# Altium project 65wLEDPowerSupply.PrjPcb (part 2 of 2)

## Sheet LED Driver.SchDoc
size 420 x 297 mm; Organization: Altium Limited; Address1: L3, 12a Rodborough Rd; Address2: Frenchs Forest; Address3: NSW; Address4: Australia 2086
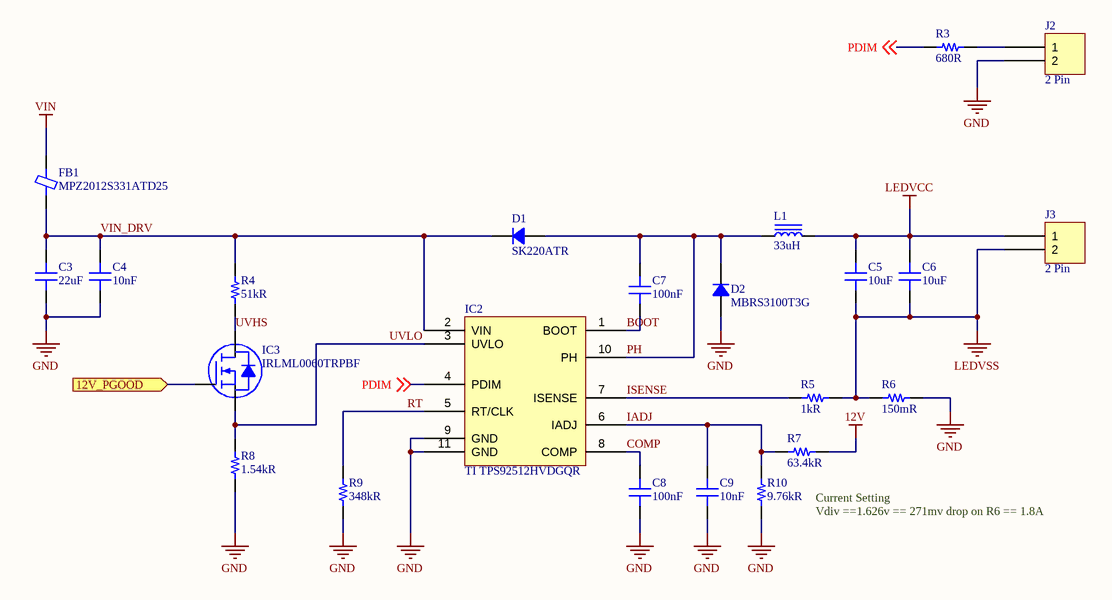
[diagram p2: LED Driver.SchDoc]

### Parts
C3  22uF  [TDK CKG57N]
C4  10nF  [CAP 0603/1608]
C5  10uF  [CAP 1210/3225 - 2.8MM]
C6  10uF  [CAP 1210/3225 - 2.8MM]
C7  100nF  [CAP 0805/2012]
C8  100nF  [CAP 0402/1005]
C9  10nF  [CAP 0402/1005]
D1  SK220ATR  [ST DO214AC SMA]
D2  MBRS3100T3G  [ST DO214AB SMC]
FB1  MPZ2012S331ATD25  [FER 0805/2012]
IC2  TI TPS92512HVDGQR  [TI MSOP-10 DGQ]
IC3  IRLML0060TRPBF  [INFINEON SOT-23-3]
J2  2 Pin  [TE 282834-2]
J3  2 Pin  [FCI 06-381-2PIN]
L1  33uH  [TDK SLF12575]
R3  680R  [RES 0402/1005]
R4  51kR  [RES 0402/1005]
R5  1kR  [RES 0402/1005]
R6  150mR  [STACKPOLE CSRN2512]
R7  63.4kR  [RES 0402/1005]
R8  1.54kR  [RES 0402/1005]
R9  348kR  [RES 0402/1005]
R10  9.76kR  [RES 0402/1005]

### Ports
12V_PGOOD (in)

### Nets
12V: R7.1
GND: C3.1 C4.1 C8.2 C9.1 D2.1 IC2.9(GND) IC2.11(GND) J2.2 R6.1 R8.1 R9.1 R10.1
LEDVCC: C5.2 C6.2 J3.1 L1.2
LEDVSS: C5.1 C6.1 J3.2 R5.2 R6.2
VIN: FB1.2
12V_PGOOD: IC3.1(G) ; port 12V_PGOOD
BOOT: C7.2 IC2.1(BOOT)
COMP: C8.1 IC2.8(COMP)
IADJ: C9.2 IC2.6(IADJ) R7.2 R10.2
ISENSE: IC2.7(ISENSE) R5.1
PDIM: IC2.4(PDIM) R3.1 ; off-sheet PDIM
PH: C7.1 D1.1 D2.2 IC2.10(PH) L1.1
RT: IC2.5(RT/CLK) R9.2
UVHS: IC3.3(D) R4.1
UVLO: IC2.3(UVLO) IC3.2(S) R8.2
VIN_DRV: C3.2 C4.2 D1.2 FB1.1 IC2.2(VIN) R4.2
NetJ2_1: J2.1 R3.2

### Notes on the sheet
- Current Setting
- Vdiv ==1.626v == 271mv drop on R6 == 1.8A
- 8
- 7
- 6
- 5
- 4
- 3
- DWG. NO.
- REV.
- SHT.
- REVISION
- 2
- DESCRIPTION
- DATE
- 1
- APPROVED
- THIS DOCUMENT AND THE DATA DISCLOSED HEREIN OR HEREWITH IS THE PROPERTY OF ALTIUM LIMITED AND MAY BE FREELY DISTRIBUTED IN WHOLE. NO RIGHTS ARE RESERVED OR EXPRESS OR IMPLIED WARANTEE GIVEN.
- F
- E
- D
- C
- B
- A
- SCALE:
- A3
- SIZE
- CAGE CODE
- FILE NAME
- DWG NO.
- SHEET
- OF
- REV

### Library data of the parts
C3 = Capacitor: TDK - CKG57NX7S2A226M500JH - CAP, 22µF, 100V, 20%, X7S, 2220; Lead/Base Style: L-Lead; Supplier 1: Digi-Key; Supplier Part Number 1: 445-5217-1-ND; Manufacturer 1: TDK; Manufacturer Part Number 1: CKG57NX7S2A226M500JH; RoHS: Yes; Category: Ceramic Capacitors; Stock 1: 59963; Pricing 1: 1=5.22000, 10=4.69600, 100=3.54830, 500=2.92216 (USD); Mount: Surface Mount; Case/Package: 2220; Number of Pins: 2; Case Code (Metric): 5750; Case Code (Imperial): 2220; Min Operating Temperature: -55°C; Max Operating Temperature: 125°C; Capacitance: 22uF; Tolerance: 20%; Voltage Rating: 100V; Packaging: Tape and Reel; Voltage Rating (DC): 100V; Dielectric: X7S; Termination: Metal; Package Quantity: 1; Composition: Ceramic; Voltage: 100V; Length: 6mm; Height: 5mm; Depth: 5mm; Width: 0.197inch; Thickness: 0.217inch; Lead Free: Lead Free; REACH SVHC: No SVHC; ComponentLink1URL: https://datasheet.ciiva.com/30054/506print-detail-pdf-phplangenpart-nockg57nx7s2a226m500jhimp-unit-xmh-30054990.pdf?src-supplier=Onlinecomponents.com; ComponentLink1Description: https://datasheet.ciiva.com/30054/506print-detail-pdf-phplangenpart-nockg57nx7s2a226m500jhimp-unit-xmh-30054990.pdf?src-supplier=Onlinecomponents.com; ComponentLink2URL: https://datasheet.ciiva.com/24216/ckg57nx7s2a226m500jh-266237-24216591.pdf?src-supplier=Mouser; ComponentLink2Description: https://datasheet.ciiva.com/24216/ckg57nx7s2a226m500jh-266237-24216591.pdf?src-supplier=Mouser; ComponentLink3URL: https://datasheet.ciiva.com/8079/1796627-8079399.pdf?src-supplier=Element14; ComponentLink3Description: https://datasheet.ciiva.com/8079/1796627-8079399.pdf?src-supplier=Element14; ComponentLink4URL: https://datasheet.ciiva.com/6283/mlcc-commercial-megacap-en-6283517.pdf?src-supplier=Digi-Key; ComponentLink4Description: https://datasheet.ciiva.com/6283/mlcc-commercial-megacap-en-6283517.pdf?src-supplier=Digi-Key; ComponentLink5URL: https://datasheet.ciiva.com/6283/mlcc-commercial-megacap-en-6283519.pdf?src-supplier=Digi-Key; ComponentLink5Description: https://datasheet.ciiva.com/6283/mlcc-commercial-megacap-en-6283519.pdf?src-supplier=Digi-Key
C4 = Capacitor: Multilayer Ceramic Capacitors MLCC - SMD/SMT .01uF 100Volts 10%; Manufacturer 1: Murata; Manufacturer Part Number 1: GRM188R72A103KA01D; Dielectric: X7R; Voltage Rating: 100V; Supplier 1: Farnell; Supplier Part Number 1: 2666521; RoHS: Yes; Category: Ceramic Capacitors; Stock 1: 4000; Pricing 1: 4000=0.01000, 20000=0.00740, 40000=0.00630 (GBP); Mount: Surface Mount; Case/Package: 0603; Case Code (Metric): 1608; Case Code (Imperial): 0603; Material: Ceramic; Min Operating Temperature: -55°C; Max Operating Temperature: 125°C; Capacitance: 10nF; Tolerance: 10%; Package Quantity: 4000; Packaging: Tape and Reel; Voltage Rating (DC): 100V; Termination: SMD/SMT; Voltage: 100V; Length: 1.6mm; Height: 0.8mm; Width: 0.031inch; Thickness: 0.035inch; Depth: 0.8mm; Radiation Hardening: No; REACH SVHC: No SVHC; Lead Free: Lead Free; ComponentLink1URL: https://datasheet.ciiva.com/6270/product-6270672.pdf?src-supplier=Digi-Key; ComponentLink1Description: https://datasheet.ciiva.com/6270/product-6270672.pdf?src-supplier=Digi-Key; ComponentLink2URL: https://datasheet.ciiva.com/18100/getdatasheetpartid-27582-18100672.pdf?src-supplier=Verical; ComponentLink2Description: https://datasheet.ciiva.com/18100/getdatasheetpartid-27582-18100672.pdf?src-supplier=Verical; ComponentLink3URL: https://datasheet.ciiva.com/11789/0900766b80ef921d-11789050.pdf?src-supplier=RSComponents; ComponentLink3Description: https://datasheet.ciiva.com/11789/0900766b80ef921d-11789050.pdf?src-supplier=RSComponents; ComponentLink4URL: https://datasheet.ciiva.com/29201/451970-da-01-en-vs-kondensator-0603-29201715.pdf?src-supplier=Conrad; ComponentLink4Description: https://datasheet.ciiva.com/29201/451970-da-01-en-vs-kondensator-0603-29201715.pdf?src-supplier=Conrad; ComponentLink5URL: https://datasheet.ciiva.com/6270/partnumbering-e-01-6270678.pdf?src-supplier=Digi-Key; ComponentLink5Description: https://datasheet.ciiva.com/6270/partnumbering-e-01-6270678.pdf?src-supplier=Digi-Key
C5 C6 = Capacitor: CAP CER 10UF 50V X7R 1210; Manufacturer 1: Samsung; Manufacturer Part Number 1: CL32B106KBJNNWE; Tolerance: 10%; Supplier 1: Digi-Key; Supplier Part Number 1: 1276-3388-1-ND; RoHS: Yes; Category: Ceramic Capacitors; Stock 1: 561396; Pricing 1: 1=0.66000, 10=0.46700, 100=0.30740, 500=0.22770 (USD); Mount: Surface Mount; Case/Package: 1210; Case Code (Metric): 3225; Case Code (Imperial): 1210; Min Operating Temperature: -55°C; Max Operating Temperature: 125°C; Capacitance: 10uF; Voltage Rating: 50V; Package Quantity: 1; Packaging: Tape and Reel; Dielectric: X7R; Length: 0.126inch; Width: 0.098inch; Thickness: 0.106inch; Lead Free: Lead Free; ComponentLink1URL: https://datasheet.ciiva.com/25721/cl32b106kbjnnwe-25721651.pdf?src-supplier=Digi-Key; ComponentLink1Description: https://datasheet.ciiva.com/25721/cl32b106kbjnnwe-25721651.pdf?src-supplier=Digi-Key
C7 = Capacitor: Multilayer Ceramic Capacitors MLCC - SMD/SMT 50volts 0.1uF X7R 20%; Manufacturer 1: KEMET; Manufacturer Part Number 1: C0805C104M5RACTU; Voltage Rating (DC): 50V; Supplier 1: Digi-Key; Supplier Part Number 1: 399-1169-1-ND; RoHS: Yes; Category: Ceramic Capacitors; Stock 1: 1391611; Pricing 1: 1=0.10000, 10=0.07400, 100=0.03290, 500=0.02348, 1000=0.01845 (USD); Mount: Surface Mount; Case/Package: 0805; Dielectric Material: Ceramic; Min Operating Temperature: -55°C; Max Operating Temperature: 125°C; Capacitance: 100nF; Tolerance: 20%; Packaging: Tape and Reel; Dielectric: X7R; Length: 2mm; Height: 0.9mm; Depth: 1.25mm; Radiation Hardening: No; ComponentLink1URL: http://uk.rs-online.com/webdocs/13da/0900766b813daa06.pdf?src-supplier=RSComponents; ComponentLink1Description: http://uk.rs-online.com/webdocs/13da/0900766b813daa06.pdf?src-supplier=RSComponents; ComponentLink2URL: http://www.farnell.com/datasheets/2315435.pdf?src-supplier=Farnell; ComponentLink2Description: http://www.farnell.com/datasheets/2315435.pdf?src-supplier=Farnell; ComponentLink3URL: http://uk.rs-online.com/webdocs/1515/0900766b81515223.pdf?src-supplier=RSComponents; ComponentLink3Description: http://uk.rs-online.com/webdocs/1515/0900766b81515223.pdf?src-supplier=RSComponents; ComponentLink4URL: http://www.farnell.com/datasheets/2739857.pdf?src-supplier=Farnell; ComponentLink4Description: http://www.farnell.com/datasheets/2739857.pdf?src-supplier=Farnell; ComponentLink5URL: https://www.verical.com/server-webapp/html/getDatasheet?partID=774625&src-supplier=Verical; ComponentLink5Description: https://www.verical.com/server-webapp/html/getDatasheet?partID=774625&src-supplier=Verical; ComponentLink6URL: http://www.farnell.com/datasheets/2120141.pdf?src-supplier=Farnell; ComponentLink6Description: http://www.farnell.com/datasheets/2120141.pdf?src-supplier=Farnell; ComponentLink7URL: http://components.arrow.com/part/dataview/0323_00324812?src-supplier=Arrow+Europe; ComponentLink7Description: http://components.arrow.com/part/dataview/0323_00324812?src-supplier=Arrow+Europe; ComponentLink8URL: http://uk.rs-online.com/webdocs/1528/0900766b81528e2f.pdf?src-supplier=RSComponents; ComponentLink8Description: http://uk.rs-online.com/webdocs/1528/0900766b81528e2f.pdf?src-supplier=RSComponents; ComponentLink9URL: http://www.farnell.com/datasheets/2739857.pdf?src-supplier=Newark; ComponentLink9Description: http://www.farnell.com/datasheets/2739857.pdf?src-supplier=Newark; ComponentLink10URL: http://www.alliedelec.com/m/d/9bfe7773041ffe9d406e68bc7b377fdd.pdf?src-supplier=Allied+Electronics; ComponentLink10Description: http://www.alliedelec.com/m/d/9bfe7773041ffe9d406e68bc7b377fdd.pdf?src-supplier=Allied+Electronics; ComponentLink11URL: http://components.arrow.com/part/dataview/2091108S8109171N7429?src-supplier=Arrow; ComponentLink11Description: http://components.arrow.com/part/dataview/2091108S8109171N7429?src-supplier=Arrow; ComponentLink12URL: http://capacitoredge.kemet.com/capedge2/DataSheet?pn=C0805C104M5RACTU&src-supplier=Avnet+Europe; ComponentLink12Description: http://capacitoredge.kemet.com/capedge2/DataSheet?pn=C0805C104M5RACTU&src-supplier=Avnet+Europe; ComponentLink13URL: http://www.mouser.com/ds/2/212/KEM_C1002_X7R_SMD-1102033.pdf?src-supplier=Mouser; ComponentLink13Description: http://www.mouser.com/ds/2/212/KEM_C1002_X7R_SMD-1102033.pdf?src-supplier=Mouser; ComponentLink14URL: http://www.farnell.com/datasheets/2120141.pdf?src-supplier=Element14; ComponentLink14Description: http://www.farnell.com/datasheets/2120141.pdf?src-supplier=Element14; ComponentLink15URL: http://www.farnell.com/datasheets/1851736.pdf?src-supplier=Element14; ComponentLink15Description: http://www.farnell.com/datasheets/1851736.pdf?src-supplier=Element14; ComponentLink16URL: https://www.verical.com/server-webapp/html/getDatasheet?partID=91523&src-supplier=Verical; ComponentLink16Description: https://www.verical.com/server-webapp/html/getDatasheet?partID=91523&src-supplier=Verical; ComponentLink17URL: https://api.kemet.com/component-edge/download/datasheet/C0805C104M5RACTU.pdf?src-supplier=Digi-Key; ComponentLink17Description: https://api.kemet.com/component-edge/download/datasheet/C0805C104M5RACTU.pdf?src-supplier=Digi-Key
C8 = Capacitor: MURATA - GRM155R62A104KE14D - CAP, 0.1µF, 100V, 10%, X5R, 0402; Supplier 1: Digi-Key; Supplier Part Number 1: 490-10458-1-ND; Manufacturer 1: Murata; Manufacturer Part Number 1: GRM155R62A104KE14D; RoHS: Yes; Category: Ceramic Capacitors; Stock 1: 539925; Pricing 1: 1=0.10000, 10=0.03500, 100=0.01580, 500=0.01128, 1000=0.00886, 2500=0.00805, 5000=0.00741 (USD); Mount: Surface Mount; Case/Package: 0402; Weight: 0.000212oz; Case Code (Metric): 1005; Case Code (Imperial): 0402; Min Operating Temperature: -55°C; Max Operating Temperature: 85°C; Capacitance: 100nF; Packaging: Tape and Reel; Voltage Rating: 100V; Dielectric: X5R; Tolerance: 10%; Termination: SMD/SMT; Voltage Rating (DC): 100V; Package Quantity: 10000; Length: 0.039inch; Height: 0.5mm; Width: 0.5mm; Thickness: 0.022inch; REACH SVHC: No SVHC; Lead Free: Lead Free; ComponentLink1URL: http://www.mouser.com/ds/2/281/c02e-2905.pdf?src-supplier=Mouser; ComponentLink1Description: http://www.mouser.com/ds/2/281/c02e-2905.pdf?src-supplier=Mouser; ComponentLink2URL: http://www.farnell.com/datasheets/2079151.pdf?src-supplier=Farnell; ComponentLink2Description: http://www.farnell.com/datasheets/2079151.pdf?src-supplier=Farnell; ComponentLink3URL: http://www.farnell.com/datasheets/2079151.pdf?src-supplier=Element14; ComponentLink3Description: http://www.farnell.com/datasheets/2079151.pdf?src-supplier=Element14; ComponentLink4URL: http://search.murata.co.jp/Ceramy/image/img/A01X/G101/ENG/GRM155R62A104KE14-01.pdf?src-supplier=Digi-Key; ComponentLink4Description: http://search.murata.co.jp/Ceramy/image/img/A01X/G101/ENG/GRM155R62A104KE14-01.pdf?src-supplier=Digi-Key; ComponentLink5URL: http://www.farnell.com/datasheets/2079151.pdf?src-supplier=Newark; ComponentLink5Description: http://www.farnell.com/datasheets/2079151.pdf?src-supplier=Newark
C9 = Capacitor: TAIYO YUDEN - TMK105B7103KV-F - CERAMIC CAPACITOR 0.01UF, 25V, X7R, 10%, 0402, FULL REEL; Supplier 1: Digi-Key; Supplier Part Number 1: 587-1223-1-ND; Manufacturer 1: Taiyo Yuden; Manufacturer Part Number 1: TMK105B7103KV-F; RoHS: Yes; Category: Ceramic Capacitors; Stock 1: 1391775; Pricing 1: 1=0.10000, 10=0.01700, 100=0.00780, 500=0.00554, 1000=0.00436, 2500=0.00396, 5000=0.00364 (USD); Mount: Surface Mount; Case/Package: 0402; Case Code (Metric): 1005; Case Code (Imperial): 0402; Contact Plating: Tin; Min Operating Temperature: -55°C; Max Operating Temperature: 125°C; Capacitance: 10nF; Tolerance: 10%; Package Quantity: 1; Voltage Rating: 25V; Packaging: Tape and Reel; Voltage Rating (DC): 25V; Dielectric: X7R; Termination: SMD/SMT; Composition: Ceramic; Voltage: 25V; Length: 1mm; Height: 0.5mm; Width: 0.02inch; Thickness: 0.022inch; Depth: 0.5mm; REACH SVHC: Unknown; Halogen Free: Halogen Free; ComponentLink1URL: https://datasheet.ciiva.com/129/tmk105b7103kv-f-ss-129699.pdf?src-supplier=Digi-Key; ComponentLink1Description: https://datasheet.ciiva.com/129/tmk105b7103kv-f-ss-129699.pdf?src-supplier=Digi-Key; ComponentLink2URL: https://datasheet.ciiva.com/30192/438tmk105b7103kv-f-30192315.pdf?src-supplier=Onlinecomponents.com; ComponentLink2Description: https://datasheet.ciiva.com/30192/438tmk105b7103kv-f-30192315.pdf?src-supplier=Onlinecomponents.com; ComponentLink3URL: https://datasheet.ciiva.com/15922/204tmk105b7103kv-f-15922348.pdf?src-supplier=Onlinecomponents.com; ComponentLink3Description: https://datasheet.ciiva.com/15922/204tmk105b7103kv-f-15922348.pdf?src-supplier=Onlinecomponents.com; ComponentLink4URL: https://datasheet.ciiva.com/30156/190tmk105b7103kv-f-30156174.pdf?src-supplier=Onlinecomponents.com; ComponentLink4Description: https://datasheet.ciiva.com/30156/190tmk105b7103kv-f-30156174.pdf?src-supplier=Onlinecomponents.com; ComponentLink5URL: https://datasheet.ciiva.com/7975/746258-7975835.pdf?src-supplier=Element14; ComponentLink5Description: https://datasheet.ciiva.com/7975/746258-7975835.pdf?src-supplier=Element14; ComponentLink6URL: https://datasheet.ciiva.com/28645/746258-28645254.pdf?src-supplier=Element14; ComponentLink6Description: https://datasheet.ciiva.com/28645/746258-28645254.pdf?src-supplier=Element14
D1 = Diode: DIODE SCHOTTKY 200V 2A SMA; Manufacturer 1: SMC; Supplier 1: Digi-Key; Supplier Part Number 1: 1655-2135-1-ND; Manufacturer Part Number 1: SK220ATR; RoHS: No; Category: Rectifier Diodes; Stock 1: 7950; Pricing 1: 1=0.34000, 10=0.25500, 100=0.12090, 500=0.09864, 1000=0.07319, 2500=0.06428 (USD); Mount: Surface Mount; Case/Package: SMA; Packaging: Cut Tape; Max Reverse Voltage (DC): 200V; Average Rectified Current: 2A; ComponentLink1URL: http://www.smc-diodes.com/propdf/SK220A%20N0942%20REV.B.pdf?src-supplier=Digi-Key; ComponentLink1Description: http://www.smc-diodes.com/propdf/SK220A%20N0942%20REV.B.pdf?src-supplier=Digi-Key
D2 = Diode: DIODE SCHOTTKY 100V 3A SMC; Manufacturer 1: ON Semiconductor; Max Surge Current: 130A; Forward Voltage: 790mV; Peak Reverse Current: 50uA; Element Configuration: Single; Polarity: Standard; Supplier 1: Digi-Key; Supplier Part Number 1: MBRS3100T3GOSCT-ND; Manufacturer Part Number 1: MBRS3100T3G; RoHS: Yes; Category: Rectifier Diodes; Stock 1: 35326; Pricing 1: 1=0.51000, 10=0.43800, 100=0.30340, 500=0.23690, 1000=0.19256 (USD); Case/Package: SMC; Number of Pins: 2; Contact Plating: Tin,Matte; Min Operating Temperature: -65°C; Max Operating Temperature: 175°C; Package Quantity: 2500; Forward Current: 3A; Packaging: Tape and Reel; Max Reverse Leakage Current: 50uA; Average Rectified Current: 3A; Max Repetitive Reverse Voltage (Vrrm): 100V; Max Forward Surge Current (Ifsm): 130A; Peak Non-Repetitive Surge Current: 130A; Termination: SMD/SMT; Voltage Rating (DC): 100V; Current Rating: 3A; Output Current: 3A; Max Reverse Voltage (DC): 100V; Length: 6.86mm; Height: 2.13mm; Width: 5.84mm; Radiation Hardening: No; REACH SVHC: No SVHC; Lead Free: Lead Free; Halogen Free: Halogen Free; ComponentLink1URL: https://datasheet.ciiva.com/5763/mbrs3100t3-d-5763024.pdf?src-supplier=Farnell; ComponentLink1Description: https://datasheet.ciiva.com/5763/mbrs3100t3-d-5763024.pdf?src-supplier=Farnell; ComponentLink2URL: https://datasheet.ciiva.com/23818/1708279-23818758.pdf?src-supplier=Newark; ComponentLink2Description: https://datasheet.ciiva.com/23818/1708279-23818758.pdf?src-supplier=Newark; ComponentLink3URL: https://datasheet.ciiva.com/4715/mbrs3100t3-d-109621-4715394.pdf?src-supplier=Mouser; ComponentLink3Description: https://datasheet.ciiva.com/4715/mbrs3100t3-d-109621-4715394.pdf?src-supplier=Mouser; ComponentLink4URL: https://datasheet.ciiva.com/916/mbrs3100t3-d-916203.pdf?src-supplier=Digi-Key; ComponentLink4Description: https://datasheet.ciiva.com/916/mbrs3100t3-d-916203.pdf?src-supplier=Digi-Key; ComponentLink5URL: https://datasheet.ciiva.com/25954/mbrs3100t3-d-25954253.pdf?src-supplier=Avnet+Europe; ComponentLink5Description: https://datasheet.ciiva.com/25954/mbrs3100t3-d-25954253.pdf?src-supplier=Avnet+Europe; ComponentLink6URL: https://datasheet.ciiva.com/7962/mbrs3100t3-d-7962821.pdf?src-supplier=Element14; ComponentLink6Description: https://datasheet.ciiva.com/7962/mbrs3100t3-d-7962821.pdf?src-supplier=Element14; ComponentLink7URL: https://datasheet.ciiva.com/16389/mbrs3100t3-d-16389739.pdf?src-supplier=Future+Electronics; ComponentLink7Description: https://datasheet.ciiva.com/16389/mbrs3100t3-d-16389739.pdf?src-supplier=Future+Electronics; ComponentLink8URL: https://datasheet.ciiva.com/8299/mbrs3100t3-d-8299854.pdf?src-supplier=Avnet; ComponentLink8Description: https://datasheet.ciiva.com/8299/mbrs3100t3-d-8299854.pdf?src-supplier=Avnet
FB1 = Ferrite Chip: Ferrite Beads 0805 330ohms 2500mA Power Line AEC-Q200; Manufacturer 1: TDK; Number of Lines: 1; Max Current Rating: 2.5A; DC Resistance (DCR): 50mR; Impedance: 330R; Tolerance: 25%; Test Frequency: 100MHz; Supplier 1: Digi-Key; Supplier Part Number 1: 445-172907-1-ND; Manufacturer Part Number 1: MPZ2012S331ATD25; RoHS: Yes; Category: Inductors; Stock 1: 5694; Pricing 1: 1=0.13000, 10=0.10400, 25=0.08120, 50=0.06740, 100=0.05800, 250=0.04644, 500=0.04178, 1000=0.03482 (USD); Mount: Surface Mount; Case/Package: 0805; Weight: 0.000194oz; Case Code (Metric): 2012; Case Code (Imperial): 0805; Min Operating Temperature: -55°C; Max Operating Temperature: 125°C; Package Quantity: 4000; Packaging: Tape and Reel; Termination: SMD/SMT; Max DC Current: 2.5A; Length: 0.079inch; Height: 0.041inch; Width: 0.049inch; Ratings: AEC-Q200; Lead Free: Lead Free; ComponentLink1URL: https://media.digikey.com/pdf/Data%20Sheets/TDK%20PDFs/MPZ_Series_Br.pdf?src-supplier=Digi-Key; ComponentLink1Description: https://media.digikey.com/pdf/Data%20Sheets/TDK%20PDFs/MPZ_Series_Br.pdf?src-supplier=Digi-Key; ComponentLink2URL: http://www.mouser.com/ds/2/400/eads_commercial_power_mpz2012_en-923646.pdf?src-supplier=Mouser; ComponentLink2Description: http://www.mouser.com/ds/2/400/eads_commercial_power_mpz2012_en-923646.pdf?src-supplier=Mouser
IC2 = TI TPS92512HVDGQR: IC LED CNV CONST CUR 2.5A 10MSOP; Manufacturer 1: Texas Instruments; Number of Outputs: 1; Max Supply Voltage: 60V; Output Voltage: 65V; Frequency: 2MHz; Max Supply Current: 407uA; Quiescent Current: 337uA; Max Output Voltage: 58V; Min Output Voltage: 200mV; Dimming: PWM; Supplier 1: Digi-Key; Supplier Part Number 1: 296-41003-1-ND; Manufacturer Part Number 1: TPS92512HVDGQR; RoHS: Yes; Category: LED Drivers; Stock 1: 8303; Pricing 1: 1=1.50000, 10=1.33700, 100=0.97440, 500=0.81576, 1000=0.63448 (USD); Mount: Surface Mount; Case/Package: MSOP; Number of Pins: 10; Weight: 0.005051oz; Contact Plating: Gold; Min Operating Temperature: -40°C; Max Operating Temperature: 125°C; Packaging: Tape and Reel; Output Current per Channel: 2.5A; Output Current: 2.5A; Package Quantity: 2500; Max Output Current: 2.5A; Lead Free: Lead Free; ComponentLink1URL: http://www.ti.com/lit/gpn/tps92512hv?src-supplier=Mouser; ComponentLink1Description: http://www.ti.com/lit/gpn/tps92512hv?src-supplier=Mouser; ComponentLink2URL: http://www.ti.com/general/docs/lit/getliterature.tsp?genericPartNumber=TPS92512&&fileType=pdf&src-supplier=Avnet+Asia; ComponentLink2Description: http://www.ti.com/general/docs/lit/getliterature.tsp?genericPartNumber=TPS92512&&fileType=pdf&src-supplier=Avnet+Asia; ComponentLink3URL: http://www.ti.com/lit/ds/symlink/tps92512.pdf?src-supplier=Digi-Key; ComponentLink3Description: http://www.ti.com/lit/ds/symlink/tps92512.pdf?src-supplier=Digi-Key
IC3 = INFINEON MOSFET N-CH SOT-23-3 GSD: MOSFET MOSFT 60V 2.7A 92mOhm 2.5nC Qg; Manufacturer 1: International Rectifier; Rise Time: 6.3ns; Gate to Source Voltage (Vgs): 16V; Turn-Off Delay Time: 6.8ns; Fall Time: 4.2ns; Input Capacitance: 290pF; Max Power Dissipation: 1.25W; Rds On Max: 92mR; Turn-On Delay Time: 5.4ns; Drain to Source Resistance: 116mR; Recovery Time: 21ns; Nominal Vgs: 2.5V; Number of Elements: 1; Element Configuration: Single; Supplier 1: Digi-Key; Supplier Part Number 1: IRLML0060TRPBFCT-ND; Manufacturer Part Number 1: IRLML0060TRPBF; RoHS: Yes; Category: MOSFETs; Stock 1: 361915; Pricing 1: 1=0.40000, 10=0.34300, 100=0.23780, 500=0.18566, 1000=0.15091 (USD); Mount: Surface Mount; Case/Package: SOT-23; Number of Pins: 3; Min Operating Temperature: -55°C; Max Operating Temperature: 150°C; Continuous Drain Current (ID): 2.7A; Package Quantity: 1; Packaging: Tape and Reel; Drain to Source Voltage (Vdss): 60V; Drain to Source Breakdown Voltage: 60V; Power Dissipation: 1.25W; Threshold Voltage: 2.5V; On-State Resistance: 92MR; Length: 3.04mm; Height: 1.02mm; Width: 1.4mm; REACH SVHC: No SVHC; Lead Free: Lead Free; ComponentLink1URL: https://datasheet.ciiva.com/6383/irlml0060pbf-6383265.pdf?src-supplier=Digi-Key; ComponentLink1Description: https://datasheet.ciiva.com/6383/irlml0060pbf-6383265.pdf?src-supplier=Digi-Key; ComponentLink2URL: https://datasheet.ciiva.com/7935/irlml0060pbf-7935677.pdf?src-supplier=Element14; ComponentLink2Description: https://datasheet.ciiva.com/7935/irlml0060pbf-7935677.pdf?src-supplier=Element14; ComponentLink3URL: https://datasheet.ciiva.com/6383/irlml0060pbf-6383262.pdf?src-supplier=Digi-Key; ComponentLink3Description: https://datasheet.ciiva.com/6383/irlml0060pbf-6383262.pdf?src-supplier=Digi-Key; ComponentLink4URL: https://datasheet.ciiva.com/16393/irlml0060pbf-16393454.pdf?src-supplier=Future+Electronics; ComponentLink4Description: https://datasheet.ciiva.com/16393/irlml0060pbf-16393454.pdf?src-supplier=Future+Electronics; ComponentLink5URL: https://datasheet.ciiva.com/29325/161182-da-01-en-mosfet-irlml0060trpbf-sot23-ir-29325526.pdf?src-supplier=Conrad; ComponentLink5Description: https://datasheet.ciiva.com/29325/161182-da-01-en-mosfet-irlml0060trpbf-sot23-ir-29325526.pdf?src-supplier=Conrad
J2 = 2 Pin: TERM BLK 2P SIDE ENT 2.54MM PCB; Manufacturer 1: TE Connectivity; Manufacturer Part Number 1: 282834-2; Plating: Brass,Steel; Number of Contacts: 2; Voltage Rating: 150V; Number of Levels: 1; Current: 10A; Connector Type: Receptacle; Interlock: No (Without); Screwless Terminal Block: Yes (With); Gender: Male; Wire Gauge (Max): 30AWG; Thread Size: M1.6; Tail Length: 3.4mm; Approvals: UL; Supplier 1: Digi-Key; Supplier Part Number 1: A98333-ND; RoHS: Yes; Category: Terminal Blocks; Stock 1: 16578; Pricing 1: 1=0.88000, 10=0.62000, 25=0.57840, 50=0.52500, 100=0.52280, 250=0.44144, 500=0.41822, 1000=0.37175, 5000=0.34852 (USD); Mount: Through Hole; Contact Plating: Tin; Color: Green; Housing Color: Green; Contact Material: Brass; Housing Material: Polyamide; Material: Nylon; Min Operating Temperature: -40°C; Max Operating Temperature: 105°C; Number of Rows: 1; Package Quantity: 300; Packaging: Bulk; Termination: Solder; Orientation: Straight; Number of Positions: 2; Number of Positions Per Level: 2; Voltage: 150V; Max Supply Voltage (AC): 150V; Number of Circuits: 2; Screw Flange: No (Without); Side Stackable: Yes (With); Max Voltage Rating (AC): 150V; Current Rating: 10A; Closed End: No (Without); Max Current Rating: 10A; Number of Poles: 2; Length: 5.54mm; Wire Gauge (Min): 30AWG; Pitch: 2.54mm; Depth: 6.5mm; Wire/Cable Gauge: 30AWG; Width: 6.5mm; Radiation Hardening: No; ELV: Compliant; Flammability Rating: UL94 V-0; Lead Free: Lead Free; REACH SVHC: Unknown; ComponentLink1URL: https://datasheet.ciiva.com/11758/0900766b80e7dc96-11758675.pdf?src-supplier=RSComponents; ComponentLink1Description: https://datasheet.ciiva.com/11758/0900766b80e7dc96-11758675.pdf?src-supplier=RSComponents; ComponentLink2URL: https://datasheet.ciiva.com/16386/282834-2-16386363.pdf?src-supplier=Future+Electronics; ComponentLink2Description: https://datasheet.ciiva.com/16386/282834-2-16386363.pdf?src-supplier=Future+Electronics; ComponentLink3URL: https://datasheet.ciiva.com/15169/getdatasheetpartid-155864-15169558.pdf?src-supplier=Verical; ComponentLink3Description: https://datasheet.ciiva.com/15169/getdatasheetpartid-155864-15169558.pdf?src-supplier=Verical; ComponentLink4URL: https://datasheet.ciiva.com/16676/eng-cs-1308389-eurostyle-terminal-blocks-0607-16676126.pdf?src-supplier=Avnet+Europe; ComponentLink4Description: https://datasheet.ciiva.com/16676/eng-cs-1308389-eurostyle-terminal-blocks-0607-16676126.pdf?src-supplier=Avnet+Europe; ComponentLink5URL: https://datasheet.ciiva.com/30166/eng-cs-1308389-eurostyle-terminal-blocks-0607-30166974.pdf?src-supplier=Onlinecomponents.com; ComponentLink5Description: https://datasheet.ciiva.com/30166/eng-cs-1308389-eurostyle-terminal-blocks-0607-30166974.pdf?src-supplier=Onlinecomponents.com; ComponentLink6URL: https://datasheet.ciiva.com/14609/70086732-14609670.pdf?src-supplier=Allied+Electronics; ComponentLink6Description: https://datasheet.ciiva.com/14609/70086732-14609670.pdf?src-supplier=Allied+Electronics; ComponentLink7URL: https://datasheet.ciiva.com/3141/eng-cs-1308389-eurostyle-terminal-blocks-0607-3141115.pdf?src-supplier=Avnet; ComponentLink7Description: https://datasheet.ciiva.com/3141/eng-cs-1308389-eurostyle-terminal-blocks-0607-3141115.pdf?src-supplier=Avnet; ComponentLink8URL: https://datasheet.ciiva.com/823/eng-cd-282834-c1-823453.pdf?src-supplier=Digi-Key; ComponentLink8Description: https://datasheet.ciiva.com/823/eng-cd-282834-c1-823453.pdf?src-supplier=Digi-Key
J3 = 2 Pin: TERM BLOCK HDR 2POS 90DEG 3.81MM; Manufacturer 1: Amphenol; Manufacturer Part Number 1: OQ0232510000G; Supplier 1: Digi-Key; Supplier Part Number 1: 609-3819-ND; RoHS: No; Stock 1: 14524; Pricing 1: 1=0.49000, 10=0.25600, 25=0.18120, 50=0.15420, 100=0.14870, 250=0.12572, 500=0.11628, 1000=0.10275, 5000=0.07842 (USD); ComponentLink1URL: http://www.anytek.com.tw/UserUpFiles/20120526/jMKyryrC5T7A.pdf?src-supplier=Digi-Key; ComponentLink1Description: http://www.anytek.com.tw/UserUpFiles/20120526/jMKyryrC5T7A.pdf?src-supplier=Digi-Key
L1 = Inductor: INDUCTOR SHIELD PWR 33UH 12575; Manufacturer 1: TDK; Manufacturer Part Number 1: SLF12575T-330M3R2-PF; Core Material: Ferrite; Tolerance: 20%; Max DC Current: 3.4A; Shielding: Shielded; Saturation Current: 3.2A; DC Resistance (DCR): 47.4mR; Test Frequency: 1kHz; Supplier 1: Digi-Key; Supplier Part Number 1: 445-173081-1-ND; RoHS: Yes; Category: Fixed Inductors; Stock 1: 2896; Pricing 1: 1=2.06000, 10=1.89800, 100=1.32830 (USD); Mount: Surface Mount; Case/Package: Nonstandard; Min Operating Temperature: -40°C; Max Operating Temperature: 105°C; Inductance: 33uH; Packaging: Tape and Reel; Package Quantity: 500; Current Rating: 3.4A; Composition: Wirewound; Termination: SMD/SMT; DC Current: 3.4A; Military Standard: Not; Length: 12.5mm; Height: 7.5mm; Width: 0.492inch; Height - Seated (Max): 0.309inch; Depth: 12.8mm; Lead Free: Lead Free; ComponentLink1URL: https://datasheet.ciiva.com/3865/print-detail-pdf-phplangenpart-noslf12575t-330m3r2-pfnreimp-unit-3865589.pdf?src-supplier=Arrow; ComponentLink1Description: https://datasheet.ciiva.com/3865/print-detail-pdf-phplangenpart-noslf12575t-330m3r2-pfnreimp-unit-3865589.pdf?src-supplier=Arrow; ComponentLink2URL: https://datasheet.ciiva.com/11802/0900766b812b7d4f-11802238.pdf?src-supplier=RSComponents; ComponentLink2Description: https://datasheet.ciiva.com/11802/0900766b812b7d4f-11802238.pdf?src-supplier=RSComponents
R3 = Resistor: ESR Series 680 Ω ±5 % 0.33 W ±200 ppm/°C 1206 SMT Anti-Surge Chip Resistor; Manufacturer 1: Rohm; Manufacturer Part Number 1: ESR18EZPJ681; Tolerance: 5%; Power Rating: 330mW; Working Voltage: 200V; Supplier 1: Digi-Key; Supplier Part Number 1: RHM680ICT-ND; RoHS: Yes; Category: Chip SMD Resistors; Stock 1: 129280; Pricing 1: 1=0.17000, 10=0.14000, 100=0.05460, 1000=0.02287, 2500=0.02096 (USD); Case/Package: 1206; Min Operating Temperature: -55°C; Max Operating Temperature: 155°C; Resistance: 680R; Temperature Coefficient: 200ppm/°C; Number of Terminations: 2; Lead Free: Lead Free; ComponentLink1URL: https://www.rohm.com/datasheet/ESR01MZPF/esr-e?src-supplier=Digi-Key; ComponentLink1Description: https://www.rohm.com/datasheet/ESR01MZPF/esr-e?src-supplier=Digi-Key; ComponentLink2URL: http://www.rohm.com/web/global/datasheet/ESR01MZPJ/esr-e?src-supplier=Future+Electronics; ComponentLink2Description: http://www.rohm.com/web/global/datasheet/ESR01MZPJ/esr-e?src-supplier=Future+Electronics
R4 = Resistor: RES SMD 51K OHM 5% 1/16W 0402; Manufacturer 1: Yageo; Manufacturer Part Number 1: RC0402JR-0751KL; Temperature Coefficient: 100ppm/°C; Power Rating: 62.5mW; Voltage Rating: 50V; Supplier 1: Digi-Key; Supplier Part Number 1: 311-51KJRCT-ND; RoHS: Yes; Category: Chip SMD Resistors; Stock 1: 392511; Pricing 1: 1=0.10000, 10=0.01300, 100=0.00530, 1000=0.00236, 2500=0.00205, 5000=0.00169 (USD); Case/Package: 0402; Number of Pins: 2; Contact Plating: Tin,Matte; Case Code (Imperial): 0402; Case Code (Metric): 1005; Min Operating Temperature: -55°C; Max Operating Temperature: 155°C; Resistance: 51kR; Tolerance: 5%; Composition: Thick Film; Packaging: Tape and Reel; Termination: SMD/SMT; Military Standard: Not; Voltage Rating (DC): 50V; Length: 1mm; Height: 0.35mm; Width: 0.5mm; Depth: 0.5mm; Radiation Hardening: No; REACH SVHC: No SVHC; Lead Free: Lead Free; ComponentLink1URL: https://datasheet.ciiva.com/7983/1018594-7983589.pdf?src-supplier=Element14; ComponentLink1Description: https://datasheet.ciiva.com/7983/1018594-7983589.pdf?src-supplier=Element14; ComponentLink2URL: https://datasheet.ciiva.com/12558/pyu-rc0402-51-rohs-l-6-r-8721-12558459.pdf?src-supplier=Mouser; ComponentLink2Description: https://datasheet.ciiva.com/12558/pyu-rc0402-51-rohs-l-6-r-8721-12558459.pdf?src-supplier=Mouser; ComponentLink3URL: https://datasheet.ciiva.com/8888/pyu-rc0402-51-rohs-l-6-8888893.pdf?src-supplier=Avnet; ComponentLink3Description: https://datasheet.ciiva.com/8888/pyu-rc0402-51-rohs-l-6-8888893.pdf?src-supplier=Avnet; ComponentLink4URL: https://datasheet.ciiva.com/16940/pyu-rc0402-51-rohs-l-6-16940349.pdf?src-supplier=Avnet+Europe; ComponentLink4Description: https://datasheet.ciiva.com/16940/pyu-rc0402-51-rohs-l-6-16940349.pdf?src-supplier=Avnet+Europe; ComponentLink5URL: https://datasheet.ciiva.com/28386/pyu-rc0402-51-rohs-l-6-28386863.pdf?src-supplier=Avnet+Europe; ComponentLink5Description: https://datasheet.ciiva.com/28386/pyu-rc0402-51-rohs-l-6-28386863.pdf?src-supplier=Avnet+Europe
R5 = Resistor: RES SMD 1K OHM 1% 1/16W 0402; Manufacturer 1: Vishay Dale; Manufacturer Part Number 1: CRCW04021K00FKED; Temperature Coefficient: 100ppm/°C; Power Rating: 63mW; Voltage Rating: 50V; Supplier 1: Digi-Key; Supplier Part Number 1: 541-1.00KLCT-ND; RoHS: Yes; Category: Chip SMD Resistors; Stock 1: 1120778; Pricing 1: 1=0.10000, 10=0.03800, 100=0.01540, 1000=0.00690, 2500=0.00599, 5000=0.00495 (USD); Mount: Surface Mount; Case/Package: 0402; Number of Pins: 2; Weight: 2.3E-05oz; Contact Plating: Tin; Case Code (Imperial): 0402; Case Code (Metric): 1005; Min Operating Temperature: -55°C; Max Operating Temperature: 155°C; Composition: Thick Film; Resistance: 1kR; Tolerance: 1%; Termination: SMD/SMT; Packaging: Tape and Reel; Package Quantity: 10; Number of Terminations: 2; Military Standard: Not; Max Power Dissipation: 63mW; Voltage Rating (DC): 50V; Features: Automotive AEC-Q200; Length: 1mm; Height: 0.35mm; Width: 0.5mm; Depth: 0.5mm; Radiation Hardening: No; REACH SVHC: Unknown; Lead Free: Lead Free; ComponentLink1URL: https://datasheet.ciiva.com/11808/0900766b80d98824-11808638.pdf?src-supplier=RSComponents; ComponentLink1Description: https://datasheet.ciiva.com/11808/0900766b80d98824-11808638.pdf?src-supplier=RSComponents; ComponentLink2URL: https://datasheet.ciiva.com/2463/dcrcwe3-2463028.pdf?src-supplier=Digi-Key; ComponentLink2Description: https://datasheet.ciiva.com/2463/dcrcwe3-2463028.pdf?src-supplier=Digi-Key; ComponentLink3URL: https://datasheet.ciiva.com/2463/dcrcwe3-2463029.pdf?src-supplier=Digi-Key; ComponentLink3Description: https://datasheet.ciiva.com/2463/dcrcwe3-2463029.pdf?src-supplier=Digi-Key; ComponentLink4URL: https://datasheet.ciiva.com/7743/dcrcwe3-7743477.pdf?src-supplier=Element14; ComponentLink4Description: https://datasheet.ciiva.com/7743/dcrcwe3-7743477.pdf?src-supplier=Element14; ComponentLink5URL: https://datasheet.ciiva.com/2463/dcrcwe3-2463030.pdf?src-supplier=Digi-Key; ComponentLink5Description: https://datasheet.ciiva.com/2463/dcrcwe3-2463030.pdf?src-supplier=Digi-Key; ComponentLink6URL: https://datasheet.ciiva.com/26316/fld-crcw-e3-data-en-26316646.pdf?src-supplier=Distrelec; ComponentLink6Description: https://datasheet.ciiva.com/26316/fld-crcw-e3-data-en-26316646.pdf?src-supplier=Distrelec; ComponentLink7URL: https://datasheet.ciiva.com/16941/dcrcwe3-16941146.pdf?src-supplier=Avnet+Europe; ComponentLink7Description: https://datasheet.ciiva.com/16941/dcrcwe3-16941146.pdf?src-supplier=Avnet+Europe; ComponentLink8URL: https://datasheet.ciiva.com/3256/dcrcwe3-3256139.pdf?src-supplier=Avnet; ComponentLink8Description: https://datasheet.ciiva.com/3256/dcrcwe3-3256139.pdf?src-supplier=Avnet; ComponentLink9URL: https://datasheet.ciiva.com/46385/1697337-46385499.pdf?src-supplier=Element14; ComponentLink9Description: https://datasheet.ciiva.com/46385/1697337-46385499.pdf?src-supplier=Element14; ComponentLink10URL: https://datasheet.ciiva.com/3256/dcrcwe3-3256140.pdf?src-supplier=Avnet; ComponentLink10Description: https://datasheet.ciiva.com/3256/dcrcwe3-3256140.pdf?src-supplier=Avnet; ComponentLink11URL: https://datasheet.ciiva.com/16721/70201119-16721452.pdf?src-supplier=Allied+Electronics; ComponentLink11Description: https://datasheet.ciiva.com/16721/70201119-16721452.pdf?src-supplier=Allied+Electronics; ComponentLink12URL: https://datasheet.ciiva.com/16287/dcrcwe3-16287807.pdf?src-supplier=Future+Electronics; ComponentLink12Description: https://datasheet.ciiva.com/16287/dcrcwe3-16287807.pdf?src-supplier=Future+Electronics
R6 = Resistor: RES 0.15 OHM 1% 2W 2512; Manufacturer 1: Stackpole Electronics; Manufacturer Part Number 1: CSRN2512FKR150; Temperature Coefficient: 200ppm/°C; Supplier 1: Digi-Key; Supplier Part Number 1: CSRN2512FKR150CT-ND; RoHS: Yes; Category: Chip SMD Resistors; Stock 1: 191606; Pricing 1: 1=0.73000, 10=0.52000, 25=0.40560, 50=0.34300, 100=0.27030, 250=0.22868, 500=0.18712 (USD); Mount: Surface Mount; Case/Package: 2512; Case Code (Metric): 6432; Case Code (Imperial): 2512; Contact Plating: Tin,Matte; Min Operating Temperature: -55°C; Max Operating Temperature: 155°C; Packaging: Tape and Reel; Resistance: 150mR; Tolerance: 1%; Power Rating: 2W; Composition: Thick Film; Number of Terminations: 2; Max Power Dissipation: 2W; Length: 0.25inch; Height: 0.028inch; Width: 0.124inch; Radiation Hardening: No; Lead Free: Lead Free; ComponentLink1URL: https://www.seielect.com/Catalog/SEI-CSR_CSRN.pdf?src-supplier=Avnet; ComponentLink1Description: https://www.seielect.com/Catalog/SEI-CSR_CSRN.pdf?src-supplier=Avnet; ComponentLink2URL: https://www.seielect.com/catalog/SEI-Packaging.pdf?src-supplier=Digi-Key; ComponentLink2Description: https://www.seielect.com/catalog/SEI-Packaging.pdf?src-supplier=Digi-Key; ComponentLink3URL: https://www.seielect.com/Catalog/SEI-CSR_CSRN.pdf?src-supplier=Digi-Key; ComponentLink3Description: https://www.seielect.com/Catalog/SEI-CSR_CSRN.pdf?src-supplier=Digi-Key
R7 = Resistor: Thick Film Resistors - SMD 63.4K OHM 1%; Manufacturer 1: Yageo; Manufacturer Part Number 1: RC0402FR-0763K4L; Temperature Coefficient: 100ppm/°C; Power Rating: 62.5mW; Voltage Rating: 50V; Max Power Dissipation: 63mW; Supplier 1: Digi-Key; Supplier Part Number 1: YAG3204CT-ND; RoHS: Yes; Category: Chip SMD Resistors; Stock 1: 821571; Pricing 1: 1=0.10000, 10=0.01600, 100=0.00640, 1000=0.00289, 2500=0.00251, 5000=0.00207 (USD); Case/Package: 0402; Contact Plating: Tin,Matte; Case Code (Imperial): 0402; Case Code (Metric): 1005; Min Operating Temperature: -55°C; Max Operating Temperature: 155°C; Resistance: 63.4kR; Tolerance: 1%; Composition: Thick Film; Packaging: Tape and Reel; Number of Terminations: 2; Termination: SMD/SMT; Military Standard: Not; Features: Moisture Resistant; Length: 1mm; Height: 0.016inch; Width: 0.02inch; Depth: 0.5mm; Lead Free: Lead Free; ComponentLink1URL: https://datasheet.ciiva.com/16867/pyu-rc0402-51-rohs-l-6-16867462.pdf?src-supplier=Avnet+Europe; ComponentLink1Description: https://datasheet.ciiva.com/16867/pyu-rc0402-51-rohs-l-6-16867462.pdf?src-supplier=Avnet+Europe; ComponentLink2URL: https://datasheet.ciiva.com/16956/pyu-rc0402-51-rohs-l-6-r-16956407.pdf?src-supplier=Future+Electronics; ComponentLink2Description: https://datasheet.ciiva.com/16956/pyu-rc0402-51-rohs-l-6-r-16956407.pdf?src-supplier=Future+Electronics; ComponentLink3URL: https://datasheet.ciiva.com/8888/pyu-rc0402-51-rohs-l-6-8888540.pdf?src-supplier=Avnet; ComponentLink3Description: https://datasheet.ciiva.com/8888/pyu-rc0402-51-rohs-l-6-8888540.pdf?src-supplier=Avnet; ComponentLink4URL: https://datasheet.ciiva.com/28397/pyu-rc0402-51-rohs-l-6-28397772.pdf?src-supplier=Avnet+Europe; ComponentLink4Description: https://datasheet.ciiva.com/28397/pyu-rc0402-51-rohs-l-6-28397772.pdf?src-supplier=Avnet+Europe
R8 = Resistor: RES SMD 1.54K OHM 1% 1/16W 0402; Manufacturer 1: Vishay; Manufacturer Part Number 1: CRCW04021K54FKED; Temperature Coefficient: 100ppm/°C; Max Power Dissipation: 63mW; Voltage Rating: 50V; Supplier 1: Digi-Key; Supplier Part Number 1: 541-1.54KLCT-ND; RoHS: Yes; Category: Chip SMD Resistors; Stock 1: 17020; Pricing 1: 1=0.10000, 10=0.03800, 100=0.01540, 1000=0.00690, 2500=0.00599, 5000=0.00495 (USD); Case/Package: 0402; Number of Pins: 2; Weight: 2.3E-05oz; Case Code (Metric): 1005; Case Code (Imperial): 0402; Contact Plating: Tin; Min Operating Temperature: -55°C; Max Operating Temperature: 155°C; Package Quantity: 10; Resistance: 1.54kR; Tolerance: 1%; Packaging: Tape and Reel; Composition: Thick Film; Number of Terminations: 2; Features: Automotive AEC-Q200; Power Rating: 63mW; Termination: SMD/SMT; Military Standard: Not; Voltage Rating (DC): 50V; Length: 1mm; Height: 0.016inch; Width: 0.02inch; Depth: 0.5mm; Radiation Hardening: No; Lead Free: Lead Free; REACH SVHC: Unknown; ComponentLink1URL: https://datasheet.ciiva.com/2525/dcrcwe3-2525600.pdf?src-supplier=Digi-Key; ComponentLink1Description: https://datasheet.ciiva.com/2525/dcrcwe3-2525600.pdf?src-supplier=Digi-Key; ComponentLink2URL: https://datasheet.ciiva.com/2525/dcrcwe3-2525601.pdf?src-supplier=Digi-Key; ComponentLink2Description: https://datasheet.ciiva.com/2525/dcrcwe3-2525601.pdf?src-supplier=Digi-Key; ComponentLink3URL: https://datasheet.ciiva.com/7670/1697337-7670149.pdf?src-supplier=Element14; ComponentLink3Description: https://datasheet.ciiva.com/7670/1697337-7670149.pdf?src-supplier=Element14; ComponentLink4URL: https://datasheet.ciiva.com/7670/1697337-7670150.pdf?src-supplier=Element14; ComponentLink4Description: https://datasheet.ciiva.com/7670/1697337-7670150.pdf?src-supplier=Element14; ComponentLink5URL: https://datasheet.ciiva.com/16776/70201119-16776486.pdf?src-supplier=Allied+Electronics; ComponentLink5Description: https://datasheet.ciiva.com/16776/70201119-16776486.pdf?src-supplier=Allied+Electronics; ComponentLink6URL: https://datasheet.ciiva.com/5541/dcrcwe3-109170-5541384.pdf?src-supplier=Mouser; ComponentLink6Description: https://datasheet.ciiva.com/5541/dcrcwe3-109170-5541384.pdf?src-supplier=Mouser; ComponentLink7URL: https://datasheet.ciiva.com/22700/1697337-22700680.pdf?src-supplier=Element14; ComponentLink7Description: https://datasheet.ciiva.com/22700/1697337-22700680.pdf?src-supplier=Element14; ComponentLink8URL: https://datasheet.ciiva.com/8336/dcrcwe3-8336666.pdf?src-supplier=Avnet; ComponentLink8Description: https://datasheet.ciiva.com/8336/dcrcwe3-8336666.pdf?src-supplier=Avnet; ComponentLink9URL: https://datasheet.ciiva.com/2525/dcrcwe3-2525599.pdf?src-supplier=Digi-Key; ComponentLink9Description: https://datasheet.ciiva.com/2525/dcrcwe3-2525599.pdf?src-supplier=Digi-Key
R9 = Resistor: Res Thick Film 0402 348K Ohm 1% 1/16W ±100ppm/°C Molded SMD Paper T/R; Manufacturer 1: Yageo; Manufacturer Part Number 1: RC0402FR-07348KL; Power Rating: 62.5mW; Voltage Rating: 50V; Max Power Dissipation: 63mW; Supplier 1: Digi-Key; Supplier Part Number 1: YAG3123CT-ND; RoHS: Yes; Category: Chip SMD Resistors; Stock 1: 323500; Pricing 1: 1=0.10000, 10=0.01600, 100=0.00640, 1000=0.00289, 2500=0.00251, 5000=0.00207 (USD); Case/Package: 0402; Contact Plating: Tin,Matte; Case Code (Imperial): 0402; Case Code (Metric): 1005; Min Operating Temperature: -55°C; Max Operating Temperature: 155°C; Tolerance: 1%; Resistance: 348kR; Composition: Thick Film; Temperature Coefficient: 100ppm/°C; Packaging: Tape and Reel; Number of Terminations: 2; Termination: SMD/SMT; Military Standard: Not; Voltage Rating (DC): 50V; Features: Moisture Resistant; Length: 1mm; Height: 0.016inch; Width: 0.02inch; Depth: 0.5mm; Lead Free: Lead Free; ComponentLink1URL: https://datasheet.ciiva.com/16857/pyu-rc0402-51-rohs-l-6-16857381.pdf?src-supplier=Avnet+Europe; ComponentLink1Description: https://datasheet.ciiva.com/16857/pyu-rc0402-51-rohs-l-6-16857381.pdf?src-supplier=Avnet+Europe; ComponentLink2URL: https://datasheet.ciiva.com/8886/pyu-rc0402-51-rohs-l-6-8886059.pdf?src-supplier=Avnet; ComponentLink2Description: https://datasheet.ciiva.com/8886/pyu-rc0402-51-rohs-l-6-8886059.pdf?src-supplier=Avnet; ComponentLink3URL: https://datasheet.ciiva.com/12558/pyu-rc0402-51-rohs-l-6-r-8721-12558590.pdf?src-supplier=Mouser; ComponentLink3Description: https://datasheet.ciiva.com/12558/pyu-rc0402-51-rohs-l-6-r-8721-12558590.pdf?src-supplier=Mouser; ComponentLink4URL: https://datasheet.ciiva.com/17066/pyu-rc0402-51-rohs-l-6-r-17066126.pdf?src-supplier=Future+Electronics; ComponentLink4Description: https://datasheet.ciiva.com/17066/pyu-rc0402-51-rohs-l-6-r-17066126.pdf?src-supplier=Future+Electronics
R10 = Resistor: Thick Film Resistors - SMD 9.76K OHM 1%; Manufacturer 1: Yageo; Manufacturer Part Number 1: RC0402FR-079K76L; Temperature Coefficient: 100ppm/°C; Power Rating: 62.5mW; Voltage Rating: 50V; Max Power Dissipation: 63mW; Supplier 1: Digi-Key; Supplier Part Number 1: YAG3270CT-ND; RoHS: Yes; Category: Chip SMD Resistors; Stock 1: 517674; Pricing 1: 1=0.10000, 10=0.01600, 100=0.00640, 1000=0.00289, 2500=0.00251, 5000=0.00207 (USD); Case/Package: 0402; Contact Plating: Tin,Matte; Case Code (Imperial): 0402; Case Code (Metric): 1005; Min Operating Temperature: -55°C; Max Operating Temperature: 155°C; Tolerance: 1%; Resistance: 9.76kR; Composition: Thick Film; Packaging: Tape and Reel; Termination: SMD/SMT; Number of Terminations: 2; Military Standard: Not; Voltage Rating (DC): 50V; Features: Moisture Resistant; Length: 1mm; Height: 0.016inch; Width: 0.5mm; Depth: 0.5mm; Lead Free: Lead Free; ComponentLink1URL: https://datasheet.ciiva.com/16858/pyu-rc0402-51-rohs-l-6-16858152.pdf?src-supplier=Avnet+Europe; ComponentLink1Description: https://datasheet.ciiva.com/16858/pyu-rc0402-51-rohs-l-6-16858152.pdf?src-supplier=Avnet+Europe; ComponentLink2URL: https://datasheet.ciiva.com/28405/pyu-rc0402-51-rohs-l-6-28405720.pdf?src-supplier=Avnet+Europe; ComponentLink2Description: https://datasheet.ciiva.com/28405/pyu-rc0402-51-rohs-l-6-28405720.pdf?src-supplier=Avnet+Europe; ComponentLink3URL: https://datasheet.ciiva.com/8891/pyu-rc0402-51-rohs-l-6-8891386.pdf?src-supplier=Avnet; ComponentLink3Description: https://datasheet.ciiva.com/8891/pyu-rc0402-51-rohs-l-6-8891386.pdf?src-supplier=Avnet

## Nets that join several sheets
12V: 12V Powersupply (8 pins), LED Driver (R7.1)
GND: Top (C1.2 C2.2 IC1.3), 12V Powersupply (13 pins), LED Driver (12 pins)
VIN: Top (C1.1 C2.1 J1.1 R1.2), 12V Powersupply (FB2.2), LED Driver (FB1.2)
12V_PGOOD: 12V Powersupply (IC4.6 R?.1), LED Driver (IC3.1)